# EAGLE schematic electrical_schematic (EAGLE 8.5.2)
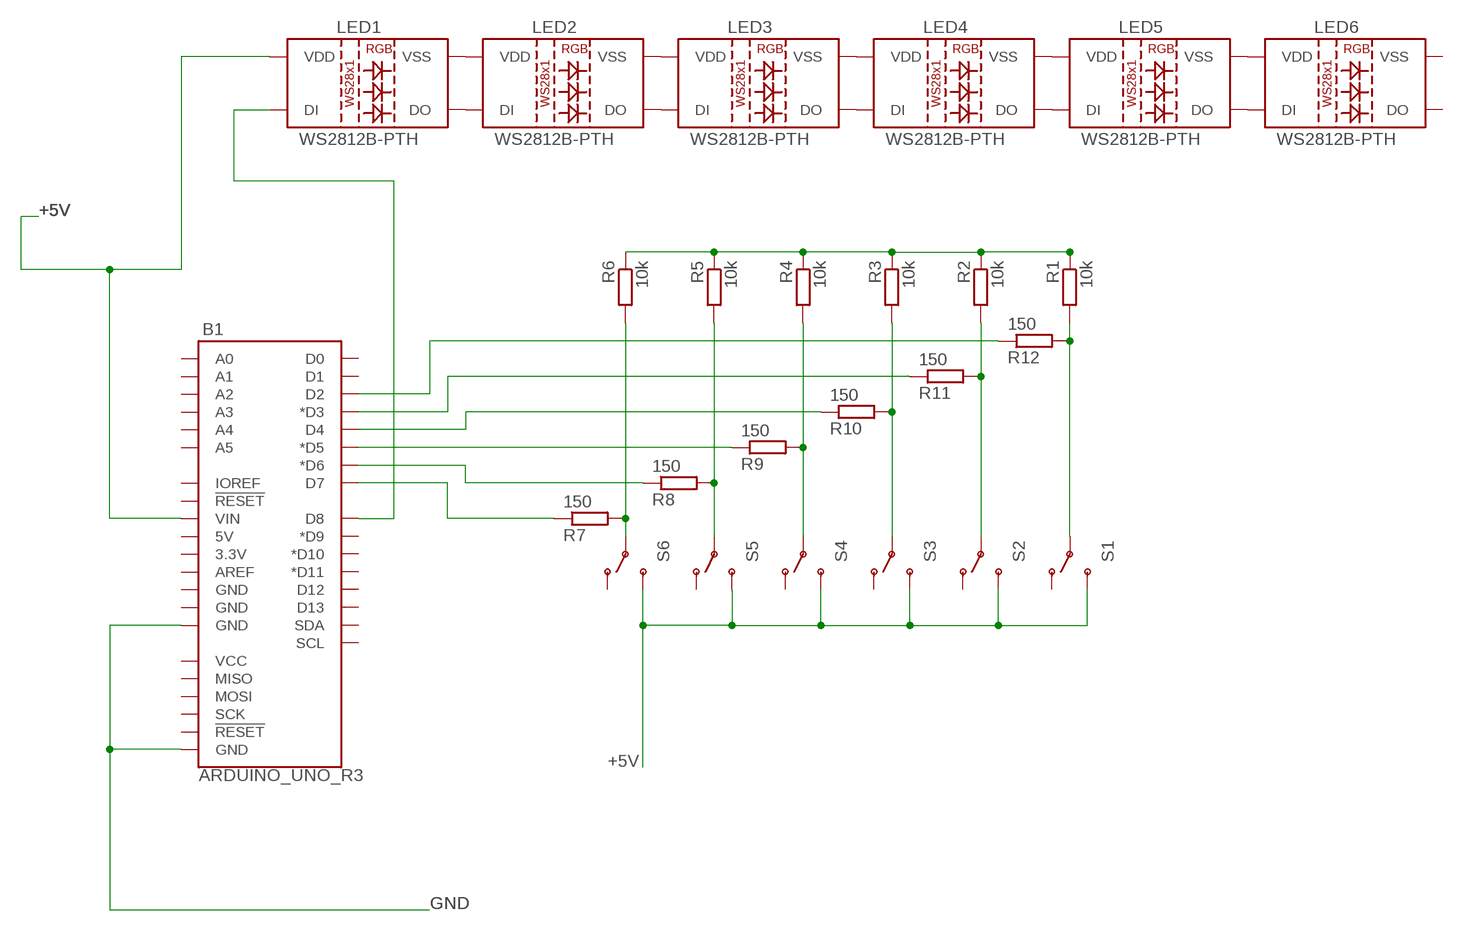
[diagram p0: schematic, sheet 1]

## Parts
B1  ARDUINO_UNO_R3  [ARDUINO_R3]
LED1  WS2812B-PTH  [WS2812B-PTH-KIT]
LED2  WS2812B-PTH  [WS2812B-PTH-KIT]
LED3  WS2812B-PTH  [WS2812B-PTH-KIT]
LED4  WS2812B-PTH  [WS2812B-PTH-KIT]
LED5  WS2812B-PTH  [WS2812B-PTH-KIT]
LED6  WS2812B-PTH  [WS2812B-PTH-KIT]
R1  10k  R-EU_0207/12  [0207/12]
R2  10k  R-EU_0207/12  [0207/12]
R3  10k  R-EU_0207/12  [0207/12]
R4  10k  R-EU_0207/12  [0207/12]
R5  10k  R-EU_0207/12  [0207/12]
R6  10k  R-EU_0207/12  [0207/12]
R7  150  R-EU_0207/12  [0207/12]
R8  150  R-EU_0207/12  [0207/12]
R9  150  R-EU_0207/12  [0207/12]
R10  150  R-EU_0207/12  [0207/12]
R11  150  R-EU_0207/12  [0207/12]
R12  150  R-EU_0207/12  [0207/12]
S1  SWITCH-SPDTPTH3  [R_SW_TH]
S2  SWITCH-SPDTPTH3  [R_SW_TH]
S3  SWITCH-SPDTPTH3  [R_SW_TH]
S4  SWITCH-SPDTPTH3  [R_SW_TH]
S5  SWITCH-SPDTPTH3  [R_SW_TH]
S6  SWITCH-SPDTPTH3  [R_SW_TH]

## Nets
+5V: B1.VIN LED1.3(VDD)
GND: B1.GND@1(GND) B1.GND@2(GND)
N$1: B1.D2 R12.1
N$2: B1.D3(*D3) R11.1
N$3: B1.D4 R10.1
N$4: R1.1 R2.1 R3.1 R4.1 R5.1 R6.1
N$5: R1.2 R12.2 S1.P$2(P)
N$6: R2.2 R11.2 S2.P$2(P)
N$7: R3.2 R10.2 S3.P$2(P)
N$8: R4.2 R9.2 S4.P$2(P)
N$9: R5.2 R8.2 S5.P$2(P)
N$10: R6.2 R7.2 S6.P$2(P)
N$11: S1.P$3(S) S2.P$3(S) S3.P$3(S) S4.P$3(S) S5.P$3(S) S6.P$3(S)
N$12: B1.D8 LED1.4(DI)
N$13: LED1.2(VSS) LED2.3(VDD)
N$14: LED1.1(DO) LED2.4(DI)
N$15: LED2.2(VSS) LED3.3(VDD)
N$16: LED2.1(DO) LED3.4(DI)
N$17: LED3.2(VSS) LED4.3(VDD)
N$18: LED3.1(DO) LED4.4(DI)
N$19: LED4.2(VSS) LED5.3(VDD)
N$20: LED4.1(DO) LED5.4(DI)
N$21: LED5.2(VSS) LED6.3(VDD)
N$22: LED5.1(DO) LED6.4(DI)
N$23: B1.D5(*D5) R9.1
N$24: B1.D6(*D6) R8.1
N$25: B1.D7 R7.1
Unconnected: B1.3.3V B1.5V B1.A0 B1.A1 B1.A2 B1.A3 B1.A4 B1.A5 B1.AREF B1.D0 B1.D1 B1.D9(*D9) B1.D10(*D10) B1.D11(*D11) B1.D12 B1.D13 B1.GND@3(GND) B1.GND@4(GND) B1.IOREF B1.MISO B1.MOSI B1.RESET@1(!RESET!) B1.RESET@2(!RESET!) B1.SCK B1.SCL B1.SDA B1.VCC LED6.1(DO) LED6.2(VSS) S1.P$1(O) S2.P$1(O) S3.P$1(O) S4.P$1(O) S5.P$1(O) S6.P$1(O)

## Library data of the parts
B1 = SparkFun-Boards:ARDUINO_UNO_R3: Arduino R3 Footprint with SPI header Arduino Uno R3 Compatible Footprint. Matches PCB size of the original board. SparkFun Products: SAMD21 Dev Breakout <https://www.sparkfun.com/products/13672> RedBoard <https://www.sparkfun.com/products/12757> R3 Stackable Headers <https://www.sparkfun.com/products/11417>
LED1-LED6 = SparkFun-LED:WS2812B-PTH: WS2812B PTH addressable RGB LED 5mm PTH LED with built-in controller IC. Color: Red/Green/Blue mC Rating: RGB: 390, 660, 180 mcd Forward Voltage: RGB: 2.0, 3.0, 3.0 V SparkFun Products: LED - RGB Addressable, PTH, 5mm Diffused (5 Pack) <https://www.sparkfun.com/products/12986> LED - RGB Addressable, PTH, 5mm Clear (5 Pack) <https://www.sparkfun.com/products/12999> Datasheet referenced for footprint: WS2812B-PTH <https://cdn.sparkfun.com/datasheets/Components/LED/COM-12877.pdf>
R1-R12 = resistor:R-EU_: RESISTOR, European symbol
S1-S6 = SparkFun-Retired:SWITCH-SPDT: SPDT Switch Simple slide switch, Spark Fun Electronics SKU : COM-00102 DPDT SMT slide switch, AYZ0202, SWCH-08179